# Altium schematic sheet cs301_YourGroupNumber.SchDoc
size A4
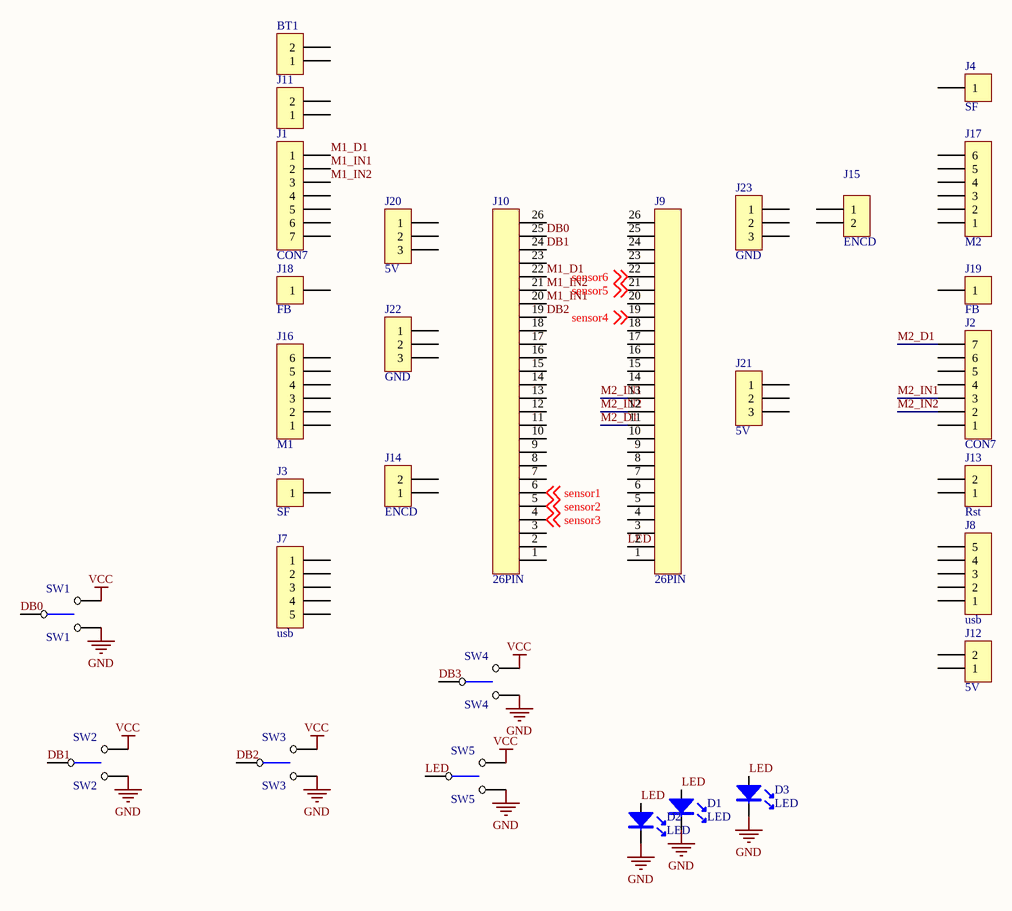
[diagram p0: cs301_YourGroupNumber.SchDoc]

## Parts
BT1  Battery  [sip2]  (value not drawn)
D1  LED  [LED0.1/5MM]
D2  LED  [LED0.1/5MM]
D3  LED  [LED0.1/5MM]
J1  CON7  [SIP7]
J2  CON7  [SIP7]
J3  SF  [SIP1/0.6]
J4  SF  [SIP1/0.6]
J7  usb  [SIP5]
J8  usb  [SIP5]
J9  26PIN  [SIP26]
J10  26PIN  [SIP26]
J11  Battery  [sip2]  (value not drawn)
J12  5V  [sip2]
J13  Rst  [sip2]
J14  ENCD  [sip2]
J15  ENCD  [sip2]
J16  M1  [sip6]
J17  M2  [sip6]
J18  FB  [SIP1/0.6]
J19  FB  [SIP1/0.6]
J20  5V  [sip3]
J21  5V  [sip3]
J22  GND  [sip3]
J23  GND  [sip3]
SW1  SW1  [SW-SPDT]
SW2  SW2  [SW-SPDT]
SW3  SW3  [SW-SPDT]
SW4  SW4  [SW-SPDT]
SW5  SW5  [SW-SPDT]

## Nets
GND: D1.K D2.K D3.K SW1.3 SW2.3 SW3.3 SW4.3 SW5.3
VCC: SW1.1 SW2.1 SW3.1 SW4.1 SW5.1
DB0: J10.25 SW1.2
DB1: J10.24 SW2.2
DB2: J10.19 SW3.2
DB3: SW4.2
LED: D1.A D2.A D3.A J9.2 SW5.2
M1_D1: J1.1 J10.22
M1_IN1: J1.2 J10.20
M1_IN2: J1.3 J10.21
M2_D1: J2.7 J9.11
M2_IN1: J2.3 J9.13
M2_IN2: J2.2 J9.12
sensor1: J10.6 ; off-sheet sensor1
sensor2: J10.5 ; off-sheet sensor2
sensor3: J10.4 ; off-sheet sensor3
sensor4: J9.19 ; off-sheet sensor4
sensor5: J9.21 ; off-sheet sensor5
sensor6: J9.22 ; off-sheet sensor6

Not connected (* = marked no-connect by the designer): BT1 1 2; J1 4 5 6 7; J2 1 4 5 6; J3 1; J4 1; J7 1 2 3 4 5; J8 1 2 3 4 5; J9 1 3 4 5 6 7 8 9 10 14 15 16 17 18 20 23 24 25 26; J10 1 2 3 7 8 9 10 11 12 13 14 15 16 17 18 23 26; J11 1 2; J12 1 2; J13 1 2; J14 1 2; J15 1 2; J16 1 2 3 4 5 6; J17 1 2 3 4 5 6; J18 1; J19 1; J20 1 2 3; J21 1 2 3; J22 1 2 3; J23 1 2 3

## Library data of the parts
BT1 J11-J15 = CON2: Connector
J1 J2 = CON7: Connector
J3 J4 J18 J19 = CON1: Connector
J7 J8 = CON5: Connector
J16 J17 = CON6: Connector
J20-J23 = CON3: Connector
SW1-SW5 = SW-SPDT: Toggle Switch